# Altium project FMC_DAC_1_5GS_4CH.PrjPCB (part 3 of 4)

## Sheet DAC_FMC_connector.SchDoc: FMC DAC 1.5GS 4CH
size 420 x 297 mm; Author: G.Kasprowicz; CompanyName: WUT ISE; DrawnBy: G.Kasprowicz; Organization: WUT ISE; Address1: PW ISE; Address2: Nowowiejska 15/19 00-665 Warsaw; Address3: gkasprow@gmail.com; Revision: 1; SheetNumber: -; SheetTotal: -; ModifiedBy: -; CheckedDate: -; Title2: FMC; DivGrp: WUT ISE; Designer: G.Kasprowicz; ModifiedDate: -; ProjectName: Sensor Box
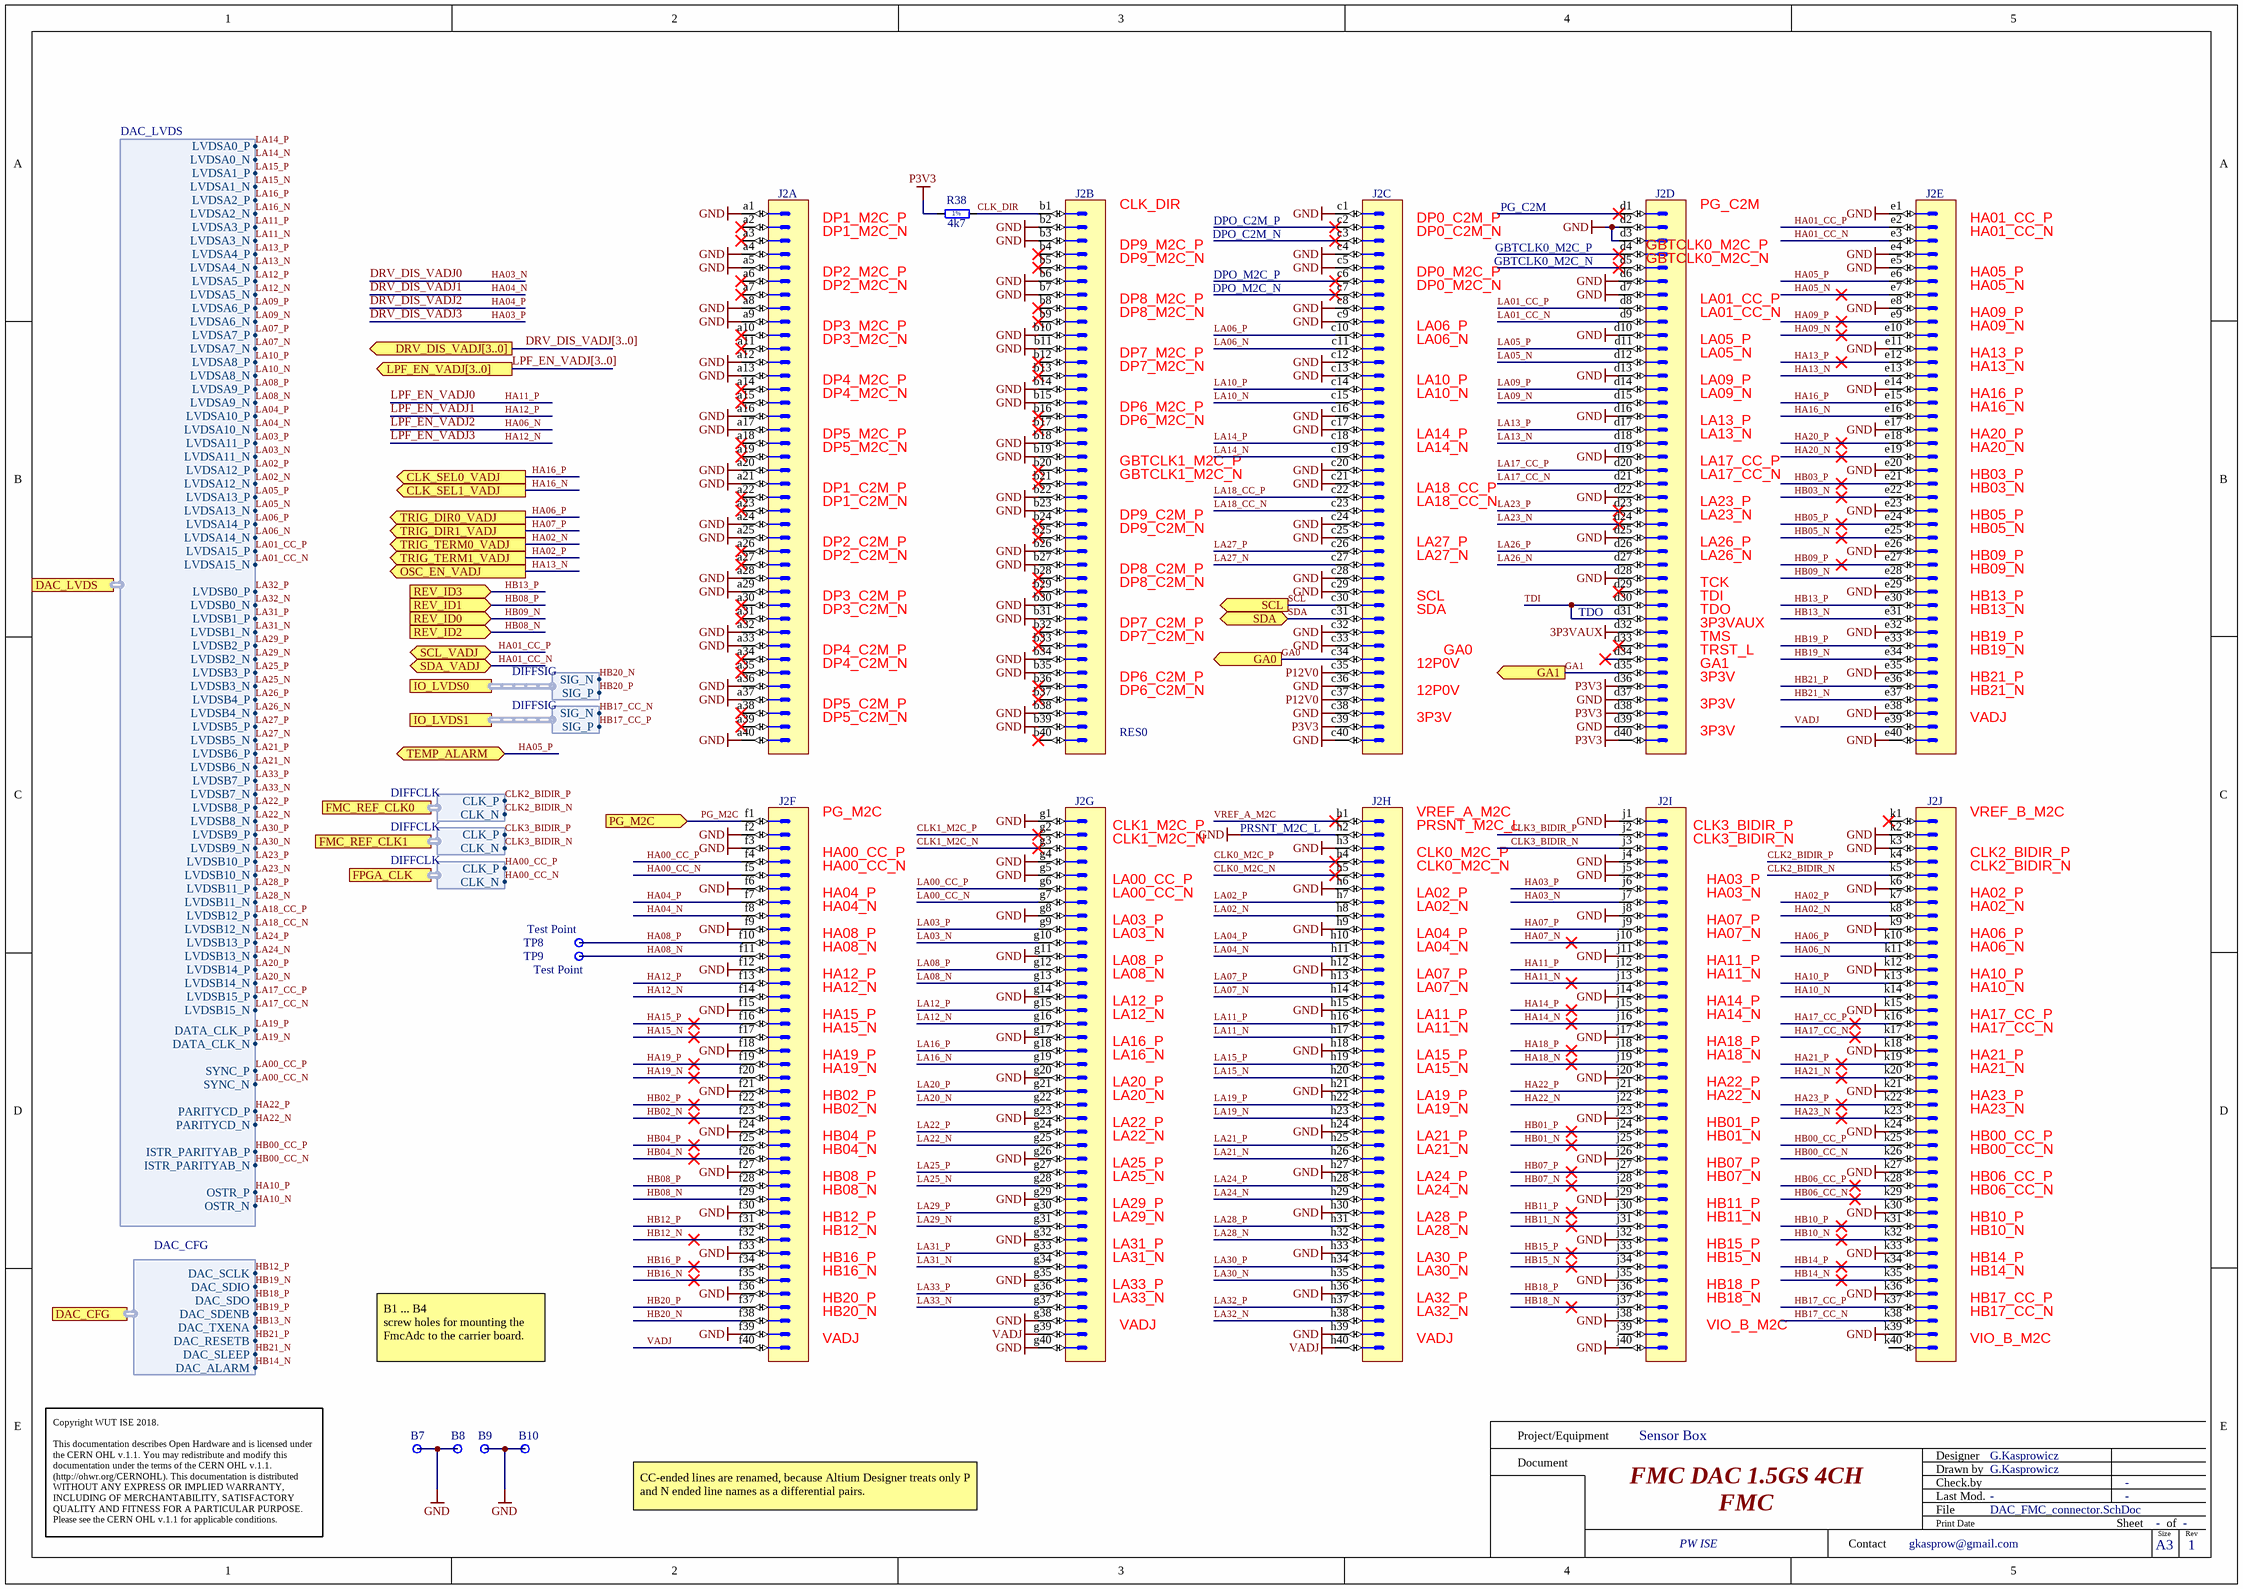
[diagram p5: DAC_FMC_connector.SchDoc]

### Parts
B7  Plated Hole  [MTG300_600]  (value not drawn)  (no BOM)
B8  Plated Hole  [MTG300_600]  (value not drawn)  (no BOM)
B9  Plated Hole  [MTG300_600]  (value not drawn)  (no BOM)
B10  Plated Hole  [MTG300_600]  (value not drawn)  (no BOM)
J2  VITA 57  [SAMTEC_ASP-134488-01]  (value not drawn)  (parts A,B,C,D,E,F,G,H,I,J of 10)
R38  4k7  [RESC1608X55N]
TP8  Test Point  [TPS127]  (no BOM)
TP9  Test Point  [TPS127]  (no BOM)

### Ports
CLK_SEL0_VADJ (out), CLK_SEL1_VADJ (out), DAC_CFG (harness DAC_CFG), DAC_LVDS (harness DAC_LVDS), DRV_DIS_VADJ[3..0] (out), FMC_REF_CLK0 (harness DIFFCLK), FMC_REF_CLK1 (harness DIFFCLK), FPGA_CLK (harness DIFFCLK), GA0 (out), GA1 (out), IO_LVDS0 (harness DIFFSIG), IO_LVDS1 (harness DIFFSIG), LPF_EN_VADJ[3..0] (out), OSC_EN_VADJ (out), PG_M2C (in), REV_ID0 (in), REV_ID1 (in), REV_ID2 (in), REV_ID3 (in), SCL (out), SCL_VADJ (bidir), SDA (bidir), SDA_VADJ (bidir), TEMP_ALARM (bidir), TRIG_DIR0_VADJ (out), TRIG_DIR1_VADJ (out), TRIG_TERM0_VADJ (out), TRIG_TERM1_VADJ (out)

### Harnesses
DAC_LVDS: LVDSA0_P, LVDSA0_N, LVDSA1_P, LVDSA1_N, LVDSA2_P, LVDSA2_N, LVDSA3_P, LVDSA3_N, LVDSA4_P, LVDSA4_N, LVDSA5_P, LVDSA5_N, LVDSA6_P, LVDSA6_N, LVDSA7_P, LVDSA7_N, LVDSA8_P, LVDSA8_N, LVDSA9_P, LVDSA9_N, LVDSA10_P, LVDSA10_N, LVDSA11_P, LVDSA11_N, LVDSA12_P, LVDSA12_N, LVDSA13_P, LVDSA13_N, LVDSA14_P, LVDSA14_N, LVDSA15_P, LVDSA15_N, LVDSB0_P, LVDSB0_N, LVDSB1_P, LVDSB1_N, LVDSB2_P, LVDSB2_N, LVDSB3_P, LVDSB3_N, LVDSB4_P, LVDSB4_N, LVDSB5_P, LVDSB5_N, LVDSB6_P, LVDSB6_N, LVDSB7_P, LVDSB7_N, LVDSB8_P, LVDSB8_N, LVDSB9_P, LVDSB9_N, LVDSB10_P, LVDSB10_N, LVDSB11_P, LVDSB11_N, LVDSB12_P, LVDSB12_N, LVDSB13_P, LVDSB13_N, LVDSB14_P, LVDSB14_N, LVDSB15_P, LVDSB15_N, DATA_CLK_P, DATA_CLK_N, SYNC_P, SYNC_N, PARITYCD_P, PARITYCD_N, ISTR_PARITYAB_P, ISTR_PARITYAB_N, OSTR_P, OSTR_N
DAC_CFG: DAC_SCLK, DAC_SDIO, DAC_SDO, DAC_SDENB, DAC_TXENA, DAC_RESETB, DAC_SLEEP, DAC_ALARM
DIFFCLK: CLK_P, CLK_N
DIFFSIG: SIG_N, SIG_P

### Nets
3P3VAUX: J2.d32
GND: B7.1 B8.1 B9.1 B10.1 J2.a1 J2.a4 J2.a5 J2.a8 J2.a9 J2.a12 J2.a13 J2.a16 J2.a17 J2.a20 J2.a21 J2.a24 J2.a25 J2.a28 J2.a29 J2.a32 J2.a33 J2.a36 J2.a37 J2.a40 J2.b2 J2.b3 J2.b6 J2.b7 J2.b10 J2.b11 J2.b14 J2.b15 J2.b18 J2.b19 J2.b22 J2.b23 J2.b26 J2.b27 J2.b30 J2.b31 J2.b34 J2.b35 J2.b38 J2.b39 J2.c1 J2.c4 J2.c5 J2.c8 J2.c9 J2.c12 J2.c13 J2.c16 J2.c17 J2.c20 J2.c21 J2.c24 J2.c25 J2.c28 J2.c29 J2.c32 J2.c33 J2.c36 J2.c38 J2.c40 J2.d2 J2.d3 J2.d6 J2.d7 J2.d10 J2.d13 J2.d16 J2.d19 J2.d22 J2.d25 J2.d28 J2.d37 J2.d39 J2.e1 J2.e4 J2.e5 J2.e8 J2.e11 J2.e14 J2.e17 J2.e20 J2.e23 J2.e26 J2.e29 J2.e32 J2.e35 J2.e38 J2.e40 J2.f2 J2.f3 J2.f6 J2.f9 J2.f12 J2.f15 J2.f18 J2.f21 J2.f24 J2.f27 J2.f30 J2.f33 J2.f36 J2.f39 J2.g1 J2.g4 J2.g5 J2.g8 J2.g11 J2.g14 J2.g17 J2.g20 J2.g23 J2.g26 J2.g29 J2.g32 J2.g35 J2.g38 J2.g40 J2.h2 J2.h3 J2.h6 J2.h9 J2.h12 J2.h15 J2.h18 J2.h21 J2.h24 J2.h27 J2.h30 J2.h33 J2.h36 J2.h39 J2.j1 J2.j4 J2.j5 J2.j8 J2.j11 J2.j14 J2.j17 J2.j20 J2.j23 J2.j26 J2.j29 J2.j32 J2.j35 J2.j38 J2.j40 J2.k2 J2.k3 J2.k6 J2.k9 J2.k12 J2.k15 J2.k18 J2.k21 J2.k24 J2.k27 J2.k30 J2.k33 J2.k36 J2.k39
P3V3: J2.c39 J2.d36 J2.d38 J2.d40 R38.1
P12V0: J2.c35 J2.c37
VADJ: J2.e39 J2.f40 J2.g39 J2.h40
CLK0_M2C_N: J2.h5
CLK0_M2C_P: J2.h4
CLK1_M2C_N: J2.g3
CLK1_M2C_P: J2.g2
CLK2_BIDIR_N: J2.k5 ; port FMC_REF_CLK0.CLK_N
CLK2_BIDIR_P: J2.k4 ; port FMC_REF_CLK0.CLK_P
CLK3_BIDIR_N: J2.j3 ; port FMC_REF_CLK1.CLK_N
CLK3_BIDIR_P: J2.j2 ; port FMC_REF_CLK1.CLK_P
CLK_DIR: J2.b1 R38.2
DRV_DIS_VADJ0: J2.j7  [also labelled HA03_N]
DRV_DIS_VADJ1: J2.f8  [also labelled HA04_N]
DRV_DIS_VADJ2: J2.f7  [also labelled HA04_P]
DRV_DIS_VADJ3: J2.j6  [also labelled HA03_P]
GA0: J2.c34 ; port GA0
GA1: J2.d35 ; port GA1
HA00_CC_N: J2.f5 ; port FPGA_CLK.CLK_N
HA00_CC_P: J2.f4 ; port FPGA_CLK.CLK_P
HA01_CC_N: J2.e3 ; port SDA_VADJ
HA01_CC_P: J2.e2 ; port SCL_VADJ
HA02_N: J2.k8 ; port TRIG_TERM0_VADJ
HA02_P: J2.k7 ; port TRIG_TERM1_VADJ
HA05_N: J2.e7
HA05_P: J2.e6 ; port TEMP_ALARM
HA06_N: J2.k11  [also labelled LPF_EN_VADJ2]
HA06_P: J2.k10 ; port TRIG_DIR0_VADJ
HA07_N: J2.j10
HA07_P: J2.j9 ; port TRIG_DIR1_VADJ
HA08_N: J2.f11 TP9.1
HA08_P: J2.f10 TP8.1
HA09_N: J2.e10
HA09_P: J2.e9
HA10_N: J2.k14 ; port DAC_LVDS.OSTR_N
HA10_P: J2.k13 ; port DAC_LVDS.OSTR_P
HA11_N: J2.j13
HA11_P: J2.j12  [also labelled LPF_EN_VADJ0]
HA12_N: J2.f14  [also labelled LPF_EN_VADJ3]
HA12_P: J2.f13  [also labelled LPF_EN_VADJ1]
HA13_N: J2.e13 ; port OSC_EN_VADJ
HA13_P: J2.e12
HA14_N: J2.j16
HA14_P: J2.j15
HA15_N: J2.f17
HA15_P: J2.f16
HA16_N: J2.e16 ; port CLK_SEL1_VADJ
HA16_P: J2.e15 ; port CLK_SEL0_VADJ
HA17_CC_N: J2.k17
HA17_CC_P: J2.k16
HA18_N: J2.j19
HA18_P: J2.j18
HA19_N: J2.f20
HA19_P: J2.f19
HA20_N: J2.e19
HA20_P: J2.e18
HA21_N: J2.k20
HA21_P: J2.k19
HA22_N: J2.j22 ; port DAC_LVDS.PARITYCD_N
HA22_P: J2.j21 ; port DAC_LVDS.PARITYCD_P
HA23_N: J2.k23
HA23_P: J2.k22
HB00_CC_N: J2.k26 ; port DAC_LVDS.ISTR_PARITYAB_N
HB00_CC_P: J2.k25 ; port DAC_LVDS.ISTR_PARITYAB_P
HB01_N: J2.j25
HB01_P: J2.j24
HB02_N: J2.f23
HB02_P: J2.f22
HB03_N: J2.e22
HB03_P: J2.e21
HB04_N: J2.f26
HB04_P: J2.f25
HB05_N: J2.e25
HB05_P: J2.e24
HB06_CC_N: J2.k29
HB06_CC_P: J2.k28
HB07_N: J2.j28
HB07_P: J2.j27
HB08_N: J2.f29 ; port REV_ID2
HB08_P: J2.f28 ; port REV_ID1
HB09_N: J2.e28 ; port REV_ID0
HB09_P: J2.e27
HB10_N: J2.k32
HB10_P: J2.k31
HB11_N: J2.j31
HB11_P: J2.j30
HB12_N: J2.f32
HB12_P: J2.f31 ; port DAC_CFG.DAC_SCLK  [project net DAC_SCLK]
HB13_N: J2.e31 ; port DAC_CFG.DAC_TXENA  [project net DAC_TXENA]
HB13_P: J2.e30 ; port REV_ID3
HB14_N: J2.k35 ; port DAC_CFG.DAC_ALARM  [project net DAC_ALARM]
HB14_P: J2.k34
HB15_N: J2.j34
HB15_P: J2.j33
HB16_N: J2.f35
HB16_P: J2.f34
HB17_CC_N: J2.k38 ; port IO_LVDS1.SIG_N
HB17_CC_P: J2.k37 ; port IO_LVDS1.SIG_P
HB18_N: J2.j37
HB18_P: J2.j36 ; port DAC_CFG.DAC_SDO  [project net DAC_SDO]
HB19_N: J2.e34 ; port DAC_CFG.DAC_SDIO  [project net DAC_SDIO]
HB19_P: J2.e33 ; port DAC_CFG.DAC_SDENB  [project net DAC_SDENB]
HB20_N: J2.f38 ; port IO_LVDS0.SIG_N
HB20_P: J2.f37 ; port IO_LVDS0.SIG_P
HB21_N: J2.e37 ; port DAC_CFG.DAC_SLEEP  [project net DAC_SLEEP]
HB21_P: J2.e36 ; port DAC_CFG.DAC_RESETB  [project net DAC_RESETB]
LA00_CC_N: J2.g7 ; port DAC_LVDS.SYNC_N
LA00_CC_P: J2.g6 ; port DAC_LVDS.SYNC_P
LA01_CC_N: J2.d9 ; port DAC_LVDS.LVDSA15_N
LA01_CC_P: J2.d8 ; port DAC_LVDS.LVDSA15_P
LA02_N: J2.h8 ; port DAC_LVDS.LVDSA12_N
LA02_P: J2.h7 ; port DAC_LVDS.LVDSA12_P
LA03_N: J2.g10 ; port DAC_LVDS.LVDSA11_N
LA03_P: J2.g9 ; port DAC_LVDS.LVDSA11_P
LA04_N: J2.h11 ; port DAC_LVDS.LVDSA10_N
LA04_P: J2.h10 ; port DAC_LVDS.LVDSA10_P
LA05_N: J2.d12 ; port DAC_LVDS.LVDSA13_N
LA05_P: J2.d11 ; port DAC_LVDS.LVDSA13_P
LA06_N: J2.c11 ; port DAC_LVDS.LVDSA14_N
LA06_P: J2.c10 ; port DAC_LVDS.LVDSA14_P
LA07_N: J2.h14 ; port DAC_LVDS.LVDSA7_N
LA07_P: J2.h13 ; port DAC_LVDS.LVDSA7_P
LA08_N: J2.g13 ; port DAC_LVDS.LVDSA9_N
LA08_P: J2.g12 ; port DAC_LVDS.LVDSA9_P
LA09_N: J2.d15 ; port DAC_LVDS.LVDSA6_N
LA09_P: J2.d14 ; port DAC_LVDS.LVDSA6_P
LA10_N: J2.c15 ; port DAC_LVDS.LVDSA8_N
LA10_P: J2.c14 ; port DAC_LVDS.LVDSA8_P
LA11_N: J2.h17 ; port DAC_LVDS.LVDSA3_N
LA11_P: J2.h16 ; port DAC_LVDS.LVDSA3_P
LA12_N: J2.g16 ; port DAC_LVDS.LVDSA5_N
LA12_P: J2.g15 ; port DAC_LVDS.LVDSA5_P
LA13_N: J2.d18 ; port DAC_LVDS.LVDSA4_N
LA13_P: J2.d17 ; port DAC_LVDS.LVDSA4_P
LA14_N: J2.c19 ; port DAC_LVDS.LVDSA0_N
LA14_P: J2.c18 ; port DAC_LVDS.LVDSA0_P
LA15_N: J2.h20 ; port DAC_LVDS.LVDSA1_N
LA15_P: J2.h19 ; port DAC_LVDS.LVDSA1_P
LA16_N: J2.g19 ; port DAC_LVDS.LVDSA2_N
LA16_P: J2.g18 ; port DAC_LVDS.LVDSA2_P
LA17_CC_N: J2.d21 ; port DAC_LVDS.LVDSB15_N
LA17_CC_P: J2.d20 ; port DAC_LVDS.LVDSB15_P
LA18_CC_N: J2.c23 ; port DAC_LVDS.LVDSB12_N
LA18_CC_P: J2.c22 ; port DAC_LVDS.LVDSB12_P
LA19_N: J2.h23 ; port DAC_LVDS.DATA_CLK_N  [project net DATA_CLK_N]
LA19_P: J2.h22 ; port DAC_LVDS.DATA_CLK_P  [project net DATA_CLK_P]
LA20_N: J2.g22 ; port DAC_LVDS.LVDSB14_N
LA20_P: J2.g21 ; port DAC_LVDS.LVDSB14_P
LA21_N: J2.h26 ; port DAC_LVDS.LVDSB6_N
LA21_P: J2.h25 ; port DAC_LVDS.LVDSB6_P
LA22_N: J2.g25 ; port DAC_LVDS.LVDSB8_N
LA22_P: J2.g24 ; port DAC_LVDS.LVDSB8_P
LA23_N: J2.d24 ; port DAC_LVDS.LVDSB10_N
LA23_P: J2.d23 ; port DAC_LVDS.LVDSB10_P
LA24_N: J2.h29 ; port DAC_LVDS.LVDSB13_N
LA24_P: J2.h28 ; port DAC_LVDS.LVDSB13_P
LA25_N: J2.g28 ; port DAC_LVDS.LVDSB3_N
LA25_P: J2.g27 ; port DAC_LVDS.LVDSB3_P
LA26_N: J2.d27 ; port DAC_LVDS.LVDSB4_N
LA26_P: J2.d26 ; port DAC_LVDS.LVDSB4_P
LA27_N: J2.c27 ; port DAC_LVDS.LVDSB5_N
LA27_P: J2.c26 ; port DAC_LVDS.LVDSB5_P
LA28_N: J2.h32 ; port DAC_LVDS.LVDSB11_N
LA28_P: J2.h31 ; port DAC_LVDS.LVDSB11_P
LA29_N: J2.g31 ; port DAC_LVDS.LVDSB2_N
LA29_P: J2.g30 ; port DAC_LVDS.LVDSB2_P
LA30_N: J2.h35 ; port DAC_LVDS.LVDSB9_N
LA30_P: J2.h34 ; port DAC_LVDS.LVDSB9_P
LA31_N: J2.g34 ; port DAC_LVDS.LVDSB1_N
LA31_P: J2.g33 ; port DAC_LVDS.LVDSB1_P
LA32_N: J2.h38 ; port DAC_LVDS.LVDSB0_N
LA32_P: J2.h37 ; port DAC_LVDS.LVDSB0_P
LA33_N: J2.g37 ; port DAC_LVDS.LVDSB7_N
LA33_P: J2.g36 ; port DAC_LVDS.LVDSB7_P
PG_M2C: J2.f1 ; port PG_M2C
SCL: J2.c30 ; port SCL
SDA: J2.c31 ; port SDA
TDI: J2.d30 J2.d31
VREF_A_M2C: J2.h1

Not connected (* = marked no-connect by the designer): J2 a2* a3* a6* a7* a10* a11* a14* a15* a18* a19* a22* a23* a26* a27* a30* a31* a34* a35* a38* a39* b4* b5* b8* b9* b12* b13* b16* b17* b20* b21* b24* b25* b28* b29* b32* b33* b36* b37* b40* c2* c3* c6* c7* d1* d4* d5* d29* d33* d34* j39 k1* k40

### Buses and harness runs
bus DRV_DIS_VADJ[3..0] = port DRV_DIS_VADJ[3..0]
bus LPF_EN_VADJ[3..0] = port LPF_EN_VADJ[3..0]

### Notes on the sheet
- DP1_M2C_P
- DP1_M2C_N
- CLK_DIR
- DP9_M2C_P
- DP9_M2C_N
- DPO_C2M_P
- DPO_C2M_N
- DP0_C2M_P
- DP0_C2M_N
- PG_C2M
- GBTCLK0_M2C_P
- GBTCLK0_M2C_N
- (near J2) GBTCLK0_M2C_P
- (near J2) GBTCLK0_M2C_N
- HA01_CC_P
- HA01_CC_N
- DP2_M2C_P
- DP2_M2C_N
- DP8_M2C_P
- DP8_M2C_N
- DPO_M2C_P
- DPO_M2C_N
- DP0_M2C_P
- DP0_M2C_N
- LA01_CC_P
- LA01_CC_N
- HA05_P
- HA05_N
- HA09_P
- DP3_M2C_P
- DP3_M2C_N
- DP4_M2C_P
- DP4_M2C_N
- DP7_M2C_P
- DP7_M2C_N
- LA06_P
- LA06_N
- LA10_P
- LA10_N
- LA05_P
- LA05_N
- LA09_P
- LA09_N
- HA09_N
- HA13_P
- HA13_N
- HA16_P
- DP5_M2C_P
- DP5_M2C_N
- DP6_M2C_P
- DP6_M2C_N
- LA14_P
- LA14_N
- LA13_P
- LA13_N
- HA16_N
- HA20_P
- HA20_N
- DP1_C2M_P
- DP1_C2M_N
- GBTCLK1_M2C_P
- GBTCLK1_M2C_N
- DP9_C2M_P
- DP9_C2M_N
- LA18_CC_P
- LA18_CC_N
- LA17_CC_P
- LA17_CC_N
- LA23_P
- LA23_N
- HB03_P
- HB03_N
- HB05_P
- HB05_N
- DP2_C2M_P
- DP2_C2M_N
- DP8_C2M_P
- DP8_C2M_N
- LA27_P
- LA27_N
- LA26_P
- LA26_N
- TCK
- HB09_P
- HB09_N
- DP3_C2M_P
- DP3_C2M_N
- DP4_C2M_P
- DP4_C2M_N
- DP7_C2M_P
- DP7_C2M_N
- SCL
- SDA
- 12P0V
- GA0
- (near J2) TDO
- TDI
- TDO
- 3P3VAUX
- TMS
- TRST_L
- GA1
- HB13_P
- HB13_N
- HB19_P
- HB19_N
- DP5_C2M_P
- DP5_C2M_N
- DP6_C2M_P
- DP6_C2M_N
- 3P3V
- HB21_P
- HB21_N
- VADJ
- RES0
- PG_M2C
- HA00_CC_P
- (near J2) CLK1_M2C_P
- (near J2) CLK1_M2C_N
- (near J2) PRSNT_M2C_L
- VREF_A_M2C
- PRSNT_M2C_L
- CLK0_M2C_P
- (near J2) CLK3_BIDIR_P
- (near J2) CLK3_BIDIR_N
- VREF_B_M2C
- CLK2_BIDIR_P
- HA00_CC_N
- HA04_P
- HA04_N
- HA08_P
- (near J2) LA00_CC_P
- (near J2) LA00_CC_N
- (near J2) LA03_P
- (near J2) LA03_N
- CLK0_M2C_N
- LA02_P
- LA02_N
- LA04_P
- HA03_P
- HA03_N
- HA07_P
- HA07_N
- CLK2_BIDIR_N
- HA02_P
- HA02_N
- HA06_P
- HA08_N
- HA12_P
- HA12_N
- (near J2) LA08_P
- (near J2) LA08_N
- LA04_N
- LA07_P
- LA07_N
- HA11_P
- HA11_N
- HA06_N
- HA10_P
- HA10_N
- HA15_P
- HA15_N
- HA19_P
- HA19_N
- (near J2) LA12_P
- (near J2) LA12_N
- (near J2) LA16_P
- (near J2) LA16_N
- LA11_P
- LA11_N
- LA15_P
- LA15_N
- HA14_P
- HA14_N
- HA18_P
- HA18_N
- HA17_CC_P
- HA17_CC_N
- HA21_P
- HA21_N
- HB02_P
- HB02_N
- (near J2) LA20_P
- (near J2) LA20_N
- (near J2) LA22_P
- LA19_P
- LA19_N
- HA22_P
- HA22_N
- HB01_P
- HA23_P
- HA23_N
- HB04_P
- HB04_N
- HB08_P
- HB08_N
- (near J2) LA22_N
- (near J2) LA25_P
- (near J2) LA25_N
- (near J2) LA29_P
- LA21_P
- LA21_N
- LA24_P
- LA24_N
- HB01_N
- HB07_P
- HB07_N
- HB11_P
- HB00_CC_P
- HB00_CC_N
- HB06_CC_P
- HB06_CC_N
- HB12_P
- HB12_N
- HB16_P
- (near J2) LA29_N
- (near J2) LA31_P
- (near J2) LA31_N
- LA28_P
- LA28_N
- LA30_P
- HB11_N
- HB15_P
- HB15_N
- HB10_P
- HB10_N
- HB14_P
- HB16_N
- HB20_P
- HB20_N
- (near J2) LA33_P
- (near J2) LA33_N
- LA30_N
- LA32_P
- LA32_N
- HB18_P
- HB18_N
- VIO_B_M2C
- HB14_N
- HB17_CC_P
- HB17_CC_N
- B1 ... B4
  screw holes for mounting the FmcAdc to the carrier board.
- CC-ended lines are renamed, because Altium Designer treats only P and N ended line names as a differential pairs.
- Project/Equipment
- Document
- Designer
- Drawn by
- Check.by
- Copyright WUT ISE 2018.
  This documentation describes Open Hardware and is licensed under the CERN OHL v.1.1. You may redistribute and modify this documentation under the terms of the CERN OHL v.1.1. (http://ohwr.org/CERNOHL). This documentation is distributed WITHOUT ANY EXPRESS OR IMPLIED WARRANTY, INCLUDING OF MERCHANTABILITY, SATISFACTORY QUALITY AND FITNESS FOR A PARTICULAR PURPOSE. Please see the CERN OHL v.1.1 for applicable conditions.
- Contact
- File
- Last Mod.
- Print Date
- Sheet
- Size
- A3
- of
- Rev
- (in symbol R0603_4K7_1%_0.1W_100PPM) 1%

### Library data of the parts
B7-B10 = PLATED_HOLE3.0_PAD6.0: Single Terminal Socket; Part Description: Plated Through Hole: Hole Dia.=3.0mm Pad Dia.=6.0mm; Mounted: No; Table: Pads; Part Number: PLATED_HOLE3.0_PAD6.0; Component Type: Standard (No BOM); Designator: Single Terminal Socket; Library Reference: Single Terminal Socket; Pin Count: 1; Family: Plated Hole; Socket: No; SMD: No; Status: None; ComponentHeight: 0mm; Author: CERN DEM JLC; CreateDate: 26.05.2008; LatestRevisionDate: 26.05.2008; PackageDescription: Plated Through Hole: Hole Dia.=3.0mm Pad Dia.=6.0mm
J2 = SAMTEC_ASP-134488-01: Connector VITA 57, 400 Male contacts in 10 row abcdefghj; Part Description: 400 contacts (10 rows abcdefghj) Surface Mount Male Connector, VITA 57 (MC-HPC-10); Manufacturer: SAMTEC; Part Number: SAMTEC_ASP-134488-01; Component Kind: Standard; Component Type: Standard; Pin Count: 400; Family: VITA 57; Mounted: Yes; Socket: No; SMD: Yes; Status: None; Manufacturer Part Number: ASP-134488-01; ComponentHeight: 6.1mm; HelpURL: \\cern.ch\dfs\Applications\Altium\Datasheets\SAMTEC_ASP-134488-01.pdf; Author: CERN DEM JLC; CreateDate: 30/04/2009; LatestRevisionDate: 17/08/2009; Table: SAMTEC
R38 = R0603_4K7_1%_0.1W_100PPM: Resistor - 1%; Part Description: General Purpose Thick Film Chip Resistor; Manufacturer: GENERIC; Manufacturer1 Part Number: NRC06F4701TRF; Power: 0.1W; TC: ±100ppm/°C; Table: Resistors SMD; Part Number: R0603_4K7_1%_0.1W_100PPM; Component Kind: Standard; Component Type: Standard; Pin Count: 2; Value: 4k7; Status: Preferred; Tolerance: ±1%; Manufacturer Part Number: R0603_4K7_1%_0.1W_100PPM; Case: 0603; Mounted: Yes; Socket: No; SMD: Yes; Manufacturer1 Example: NIC COMPONENT; Manufacturer1 ComponentHeight: 0.55mm; HelpURL: \\cern.ch\dfs\Applications\Altium\Datasheets\R0603_NIC_NRC.pdf; Author: CERN DEM JLC; CreateDate: 03/12/2007; LatestRevisionDate: 13/03/2008
TP8 TP9 = SMD_PAD_1.27X1.27MM: Part Description: 1.27mm x 1.27mm PCB Copper Area (SMD Test Point); Mounted: No; Part Number: SMD_PAD_1.27X1.27MM; Component Type: Standard (No BOM); Pin Count: 1; Family: Test Point; Socket: No; SMD: Yes; Sense: No; Status: None; ComponentHeight: 0mm; HelpURL: Undefined; Author: CERN DEM JLC; CreateDate: 12.01.2008; LatestRevisionDate: 12.01.2008; PackageDescription: 1.27mm x 1.27mm PCB Copper Area (SMD Test Point)

## Sheet Driver_Filter.schdoc: FMC DAC 1.5GS 4CH
size 420 x 297 mm; EDA_Number: ARTIQ; Projet: ARTIQ/SINARA; Author: G.Kasprowicz; CompanyName: WUT ISE; DrawnBy: G.Kasprowicz; Organization: WUT ISE; Address1: PW ISE; Address2: Nowowiejska 15/19 00-665 Warsaw; Address3: gkasprow@gmail.com; DocumentNumber: 1; Revision: 1; SheetNumber: 1; SheetTotal: 18; ModifiedBy: -; CheckedDate: -; Title2: Top; DivGrp: WUT ISE; Designer: G.Kasprowicz; ModifiedDate: -; ProjectName: Sensor Box
Used 4 times, as channels U_Driver_Filter0, U_Driver_Filter1, U_Driver_Filter2, U_Driver_Filter3. Parts and nets are listed once, with the designators drawn on the sheet.
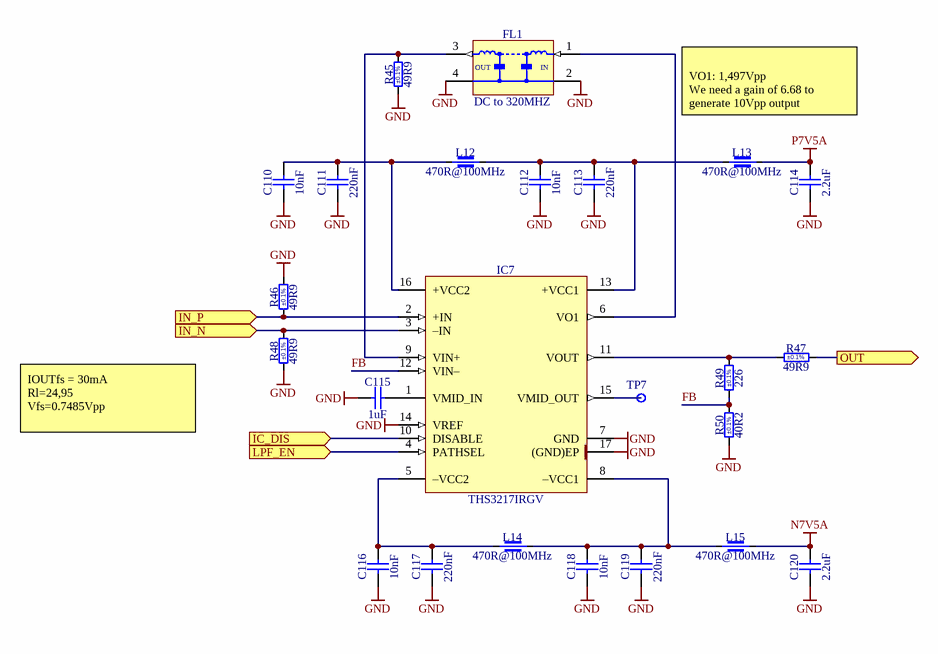
[diagram p6: Driver_Filter.schdoc]

### Parts
C110  10nF  [CAPC1005X55N]
C111  220nF  [CAPC1005X55N]
C112  10nF  [CAPC1005X55N]
C113  220nF  [CAPC1005X55N]
C114  2.2uF  [CAPC1005X55N]
C115  1uF  [CAPC1005X55N]
C116  10nF  [CAPC1005X55N]
C117  220nF  [CAPC1005X55N]
C118  10nF  [CAPC1005X55N]
C119  220nF  [CAPC1005X55N]
C120  2.2uF  [CAPC1005X55N]
FL1  DC to 320MHZ  [FIL_MINI-CIRCUITS_FV1206]
IC7  THS3217IRGV  [QFN65P400X400X100-17N-S225]
L12  470R@100MHz  [INDC1608X95N]
L13  470R@100MHz  [INDC1608X95N]
L14  470R@100MHz  [INDC1608X95N]
L15  470R@100MHz  [INDC1608X95N]
R45  49R9  Tolerance: ±0.1%  [RESC1608X55N]
R46  49R9  Tolerance: ±0.1%  [RESC1608X55N]
R47  49R9  Tolerance: ±0.1%  [RESC1608X55N]
R48  49R9  Tolerance: ±0.1%  [RESC1608X55N]
R49  226  Tolerance: ±0.1%  [RESC1608X55N]
R50  40R2  Tolerance: ±0.1%  [RESC1608X55N]
TP7  Test Point  [TPS127]  (value not drawn)  (no BOM)

### Ports
IC_DIS (in), IN_N (in), IN_P (in), LPF_EN (in), OUT (out)

### Nets
GND: C110.1 C111.1 C112.1 C113.1 C114.1 C115.1 C116.1 C117.1 C118.1 C119.1 C120.1 FL1.2(GND) FL1.4(GND) IC7.7(GND) IC7.14(VREF) IC7.17((GND)EP) R45.1 R46.2 R48.1 R50.1
N7V5A: C120.2 L15.2
P7V5A: C114.2 L13.2
FB: IC7.12(VIN–) R49.1 R50.2
IC_DIS: IC7.10(DISABLE) ; port IC_DIS
IN_N: IC7.3(–IN) R48.2 ; port IN_N
IN_P: IC7.2(+IN) R46.1 ; port IN_P
LPF_EN: IC7.4(PATHSEL) ; port LPF_EN
OUT: R47.2 ; port OUT
NetC110_2: C110.2 C111.2 IC7.16(+VCC2) L12.1
NetC112_2: C112.2 C113.2 IC7.13(+VCC1) L12.2 L13.1
NetC115_2: C115.2 IC7.1(VMID_IN)
NetC116_2: C116.2 C117.2 IC7.5(–VCC2) L14.1
NetC118_2: C118.2 C119.2 IC7.8(–VCC1) L14.2 L15.1
NetFL1_1: FL1.1(RFIN) IC7.6(VO1)
NetFL1_3: FL1.3(RFOUT) IC7.9(VIN+) R45.2
NetIC7_11: IC7.11(VOUT) R47.1 R49.2
NetIC7_15: IC7.15(VMID_OUT) TP7.1

### Channels
U_Driver_Filter0: designators end in A; ports IC_DIS=DRV_DIS0 IN_N=IOUTA_N IN_P=IOUTA_P LPF_EN=LPF_EN0 OUT=NetJ3_1
U_Driver_Filter1: designators end in B; ports IC_DIS=DRV_DIS1 IN_N=IOUTB_N IN_P=IOUTB_P LPF_EN=LPF_EN1 OUT=NetJ4_1
U_Driver_Filter2: designators end in C; ports IC_DIS=DRV_DIS2 IN_N=IOUTC_N IN_P=IOUTC_P LPF_EN=LPF_EN2 OUT=NetJ6_1
U_Driver_Filter3: designators end in D; ports IC_DIS=DRV_DIS3 IN_N=IOUTD_N IN_P=IOUTD_P LPF_EN=LPF_EN3 OUT=NetJ7_1

### Notes on the sheet
- VO1: 1,497Vpp
  We need a gain of 6.68 to generate 10Vpp output
- IOUTfs = 30mA
  Rl=24,95
  Vfs=0.7485Vpp
- Project/Equipment
- Document
- Designer
- Drawn by
- Check.by
- Copyright WUT ISE 2018.
  This documentation describes Open Hardware and is licensed under the CERN OHL v.1.1. You may redistribute and modify this documentation under the terms of the CERN OHL v.1.1. (http://ohwr.org/CERNOHL). This documentation is distributed WITHOUT ANY EXPRESS OR IMPLIED WARRANTY, INCLUDING OF MERCHANTABILITY, SATISFACTORY QUALITY AND FITNESS FOR A PARTICULAR PURPOSE. Please see the CERN OHL v.1.1 for applicable conditions.
- Contact
- File
- Last Mod.
- Print Date
- Sheet
- Size
- A3
- of
- Rev
- (in symbol FIL_MINI-CIRCUITS_LFCN-320+) OUT; IN

### Library data of the parts
C110 C112 C116 C118 = CC0402_10NF_16V_10%_X7R: Non-polarised capacitor; Part Description: SMD Multilayer Chip Ceramic Capacitor; Manufacturer: GENERIC; Manufacturer1 Part Number: 223878715636; Voltage: 16V; TC: X7R; Tolerance: ±10%; Part Number: CC0402_10NF_16V_10%_X7R; Component Kind: Standard; Component Type: Standard; Pin Count: 2; Value: 10nF; Status: Not Recommended; Manufacturer Part Number: CC0402_10NF_16V_10%_X7R; Case: 0402; Mounted: Yes; Socket: No; SMD: Yes; Sense: No; Manufacturer1 Example: PHYCOMP; Manufacturer1 ComponentHeight: 0.55mm; HelpURL: \\cern.ch\dfs\Applications\Altium\Datasheets\CC0402_X7R_PHYCOMP.pdf; Author: CERN DEM JLC; CreateDate: 03.12.2007; LatestRevisionDate: 03.12.2007
C111 C113 C117 C119 = CC0402_220NF_16V_10%_X7R: Non-polarised capacitor; Part Description: SMD Multilayer Chip Ceramic Capacitor; Manufacturer: GENERIC; Manufacturer1 Part Number: C1005X7R1C224K050; Voltage: 16V; TC: X7R; Tolerance: ±10%; Part Number: CC0402_220NF_16V_10%_X7R; Component Kind: Standard; Component Type: Standard; Pin Count: 2; Value: 220nF; Status: Preferred; Manufacturer Part Number: CC0402_220NF_16V_10%_X7R; Case: 0402; Mounted: Yes; Socket: No; SMD: Yes; Sense: No; Manufacturer1 Example: TDK; Manufacturer1 ComponentHeight: 0.55mm; HelpURL: \\cern.ch\dfs\Applications\Altium\Datasheets\CC0402_X7R_TDK_C.pdf; Author: CERN DEM JLC; CreateDate: 25.10.2012; LatestRevisionDate: 25.10.2012
C114 C120 = CC0402_2.2UF_16V_10%_X5R: Non-polarised capacitor; Part Description: SMD Multilayer Chip Ceramic Capacitor; Manufacturer: GENERIC; Manufacturer1 Part Number: C1005X5R1C225K050BC; Voltage: 16V; TC: X5R; Tolerance: ±10%; Part Number: CC0402_2.2UF_16V_10%_X5R; Component Kind: Standard; Component Type: Standard; Pin Count: 2; Value: 2.2uF; Status: Preferred; Manufacturer Part Number: CC0402_2.2UF_16V_10%_X5R; Case: 0402; Mounted: Yes; Socket: No; SMD: Yes; Sense: No; Manufacturer1 Example: TDK; Manufacturer1 ComponentHeight: 0.55mm; HelpURL: \\cern.ch\dfs\Applications\Altium\Datasheets\CC0402_X5R_TDK_C.pdf; Author: CERN DEM BC; CreateDate: 08.02.2021; LatestRevisionDate: 08.02.2021
C115 = CC0402_1UF_16V_10%_X5R: Non-polarised capacitor; Part Description: SMD Multilayer Chip Ceramic Capacitor; Manufacturer: GENERIC; Manufacturer1 Part Number: C1005X5R1C105KT; Voltage: 16V; TC: X5R; Tolerance: ±10%; Part Number: CC0402_1UF_16V_10%_X5R; Component Kind: Standard; Component Type: Standard; Pin Count: 2; Value: 1uF; Status: Preferred; Manufacturer Part Number: CC0402_1UF_16V_10%_X5R; Case: 0402; Mounted: Yes; Socket: No; SMD: Yes; Sense: No; Manufacturer1 Example: TDK; Manufacturer1 ComponentHeight: 0.55mm; HelpURL: \\cern.ch\dfs\Applications\Altium\Datasheets\CC0402_X5R_TDK_C.pdf; Author: CERN DEM JLC; CreateDate: 25.10.2012; LatestRevisionDate: 25.10.2012
FL1 = FIL_MINI-CIRCUITS_LFCN-320+: 50 Ohm Low Pass Filter; Part Number: FIL_MINI-CIRCUITS_LFCN-320+; Component Kind: Standard; Component Type: Standard; Pin Count: 4; Value: DC to 320MHZ; Part Description: 50 Ohm Low Pass Filter; Manufacturer: MINI-CIRCUITS; Manufacturer Part Number: LFCN-320+; Mounted: Yes; Socket: No; SMD: Yes; Sense: No; ComponentHeight: 0.94mm; HelpURL: \\cern.ch\dfs\Applications\Altium\Datasheets\FIL_MINI-CIRCUITS_LFCN-320+.pdf; Author: CERN DEM MR; CreateDate: 29.09.2017; LatestRevisionDate: 29.09.2017
IC7 = THS3217IRGV: DC to 800-MHz, Differential-to-Single-Ended, DAC Output Amplifier; Manufacturer: TEXAS INSTRUMENTS; PressFit: No; Bonding: No; Part Number: THS3217IRGV; Component Kind: Standard; Component Type: Standard; Device: THS3217IRGV; PackageDescription: QFN, 0.65mm Pitch; Square; 16 Pin, 4.00mm L X 4.00mm W X 1.00mm H body (w/Thermal Tab 2.25 X 2.25mm), IPC Medium Density; Part Description: DC to 800-MHz, Differential-to-Single-Ended, DAC Output Amplifier; Manufacturer Part Number: THS3217IRGV; Pin Count: 17; Case: QFN16; Mounted: Yes; Socket: No; SMD: Yes; Sense: No; ComponentHeight: 1mm; Author: CERN DEM HF; HelpURL: \\cern.ch\dfs\Applications\Altium\Datasheets\THS3217.pdf; CreateDate: 22.10.2021; LatestRevisionDate: 22.10.2021
L12-L15 = IND0603_MURATA_BLM18PG471SN1D: Part Description: SMD EMIFIL Chip Ferrite Bead; Manufacturer: MURATA; Power: 1A; Resistance: 0.2R; Tolerance: ±25%; Part Number: IND0603_MURATA_BLM18PG471SN1D; Component Kind: Standard; Component Type: Standard; Pin Count: 2; Value: 470R@100MHz; Manufacturer Part Number: BLM18PG471SN1D; Case: 0603; Mounted: Yes; Socket: No; SMD: Yes; Sense: No; ComponentHeight: 0.95mm; HelpURL: \\cern.ch\dfs\Applications\Altium\Datasheets\IND0603_MURATA_BLM18P.pdf; Author: CERN DEM BC; CreateDate: 17.02.2021; LatestRevisionDate: 17.02.2021
R45-R48 = R0603_49R9_0.1%_0.063W_10PPM: Resistor - 0.1%; Part Description: Thin Film Chip Resistor; Manufacturer: GENERIC; Manufacturer1 Part Number: RN73C1J49R9BTDF; Power: 0.063W; TC: ±10ppm; PressFit: No; Part Number: R0603_49R9_0.1%_0.063W_10PPM; Component Kind: Standard; Component Type: Standard; Pin Count: 2; Value: 49R9; Status: Not Recommended; Manufacturer Part Number: R0603_49R9_0.1%_0.063W_10PPM; Case: 0603; Mounted: Yes; Sense: No; Socket: No; SMD: Yes; Manufacturer1 Example: TYCO HOLSWORTHY; Manufacturer1 ComponentHeight: 0.5mm; HelpURL: \\cern.ch\dfs\Applications\Altium\Datasheets\R0603_Tyco_RN73.pdf; Author: CERN DEM JLC; CreateDate: 03.12.2007; LatestRevisionDate: 13.03.2008
R49 = R0603_226R_0.1%_0.063W_10PPM: Resistor - 0.1%; Part Description: Thin Film Chip Resistor; Manufacturer: GENERIC; Manufacturer1 Part Number: RN73C1J226RBTDF; Power: 0.063W; TC: ±10ppm; PressFit: No; Part Number: R0603_226R_0.1%_0.063W_10PPM; Component Kind: Standard; Component Type: Standard; Pin Count: 2; Value: 226; Status: Not Recommended; Manufacturer Part Number: R0603_226R_0.1%_0.063W_10PPM; Case: 0603; Mounted: Yes; Sense: No; Socket: No; SMD: Yes; Manufacturer1 Example: TYCO HOLSWORTHY; Manufacturer1 ComponentHeight: 0.5mm; HelpURL: \\cern.ch\dfs\Applications\Altium\Datasheets\R0603_Tyco_RN73.pdf; Author: CERN DEM JLC; CreateDate: 03.12.2007; LatestRevisionDate: 13.03.2008
R50 = R0603_40R2_0.1%_0.063W_10PPM: Resistor - 0.1%; Part Description: Thin Film Chip Resistor; Manufacturer: GENERIC; Manufacturer1 Part Number: RN73C1J40R2BTDF; Power: 0.063W; TC: ±10ppm; PressFit: No; Part Number: R0603_40R2_0.1%_0.063W_10PPM; Component Kind: Standard; Component Type: Standard; Pin Count: 2; Value: 40R2; Status: Not Recommended; Manufacturer Part Number: R0603_40R2_0.1%_0.063W_10PPM; Case: 0603; Mounted: Yes; Sense: No; Socket: No; SMD: Yes; Manufacturer1 Example: TYCO HOLSWORTHY; Manufacturer1 ComponentHeight: 0.5mm; HelpURL: \\cern.ch\dfs\Applications\Altium\Datasheets\R0603_Tyco_RN73.pdf; Author: CERN DEM JLC; CreateDate: 03.12.2007; LatestRevisionDate: 13.03.2008
TP7 = SMD_PAD_1.27X1.27MM: as TP8 on sheet DAC_FMC_connector; Part Number: SMD_PAD_1.27X1.27MM; Component Type: Standard (No BOM); Pin Count: 1; Family: Test Point; Socket: No; SMD: No; Sense: No; Status: None; ComponentHeight: 0mm; HelpURL: Undefined; Author: CERN DEM JLC; CreateDate: 12.01.2008; LatestRevisionDate: 12.01.2008; PackageDescription: 1.27mm x 1.27mm PCB Copper Area (SMD Test Point)

## Sheet EEPROM_Temp.SchDoc: FMC DAC 1.5GS 4CH
size 420 x 297 mm; Author: G.Kasprowicz; CompanyName: WUT ISE; DrawnBy: G.Kasprowicz; Organization: WUT ISE; Address1: PW ISE; Address2: Nowowiejska 15/19 00-665 Warsaw; Address3: gkasprow@gmail.com; DocumentNumber: 8; Revision: 1; SheetNumber: 8; SheetTotal: 10; ModifiedBy: -; CheckedDate: -; Title2: EEPROM, temperature sensor; DivGrp: WUT ISE; Designer: G.Kasprowicz; ModifiedDate: -; ProjectName: Sensor Box
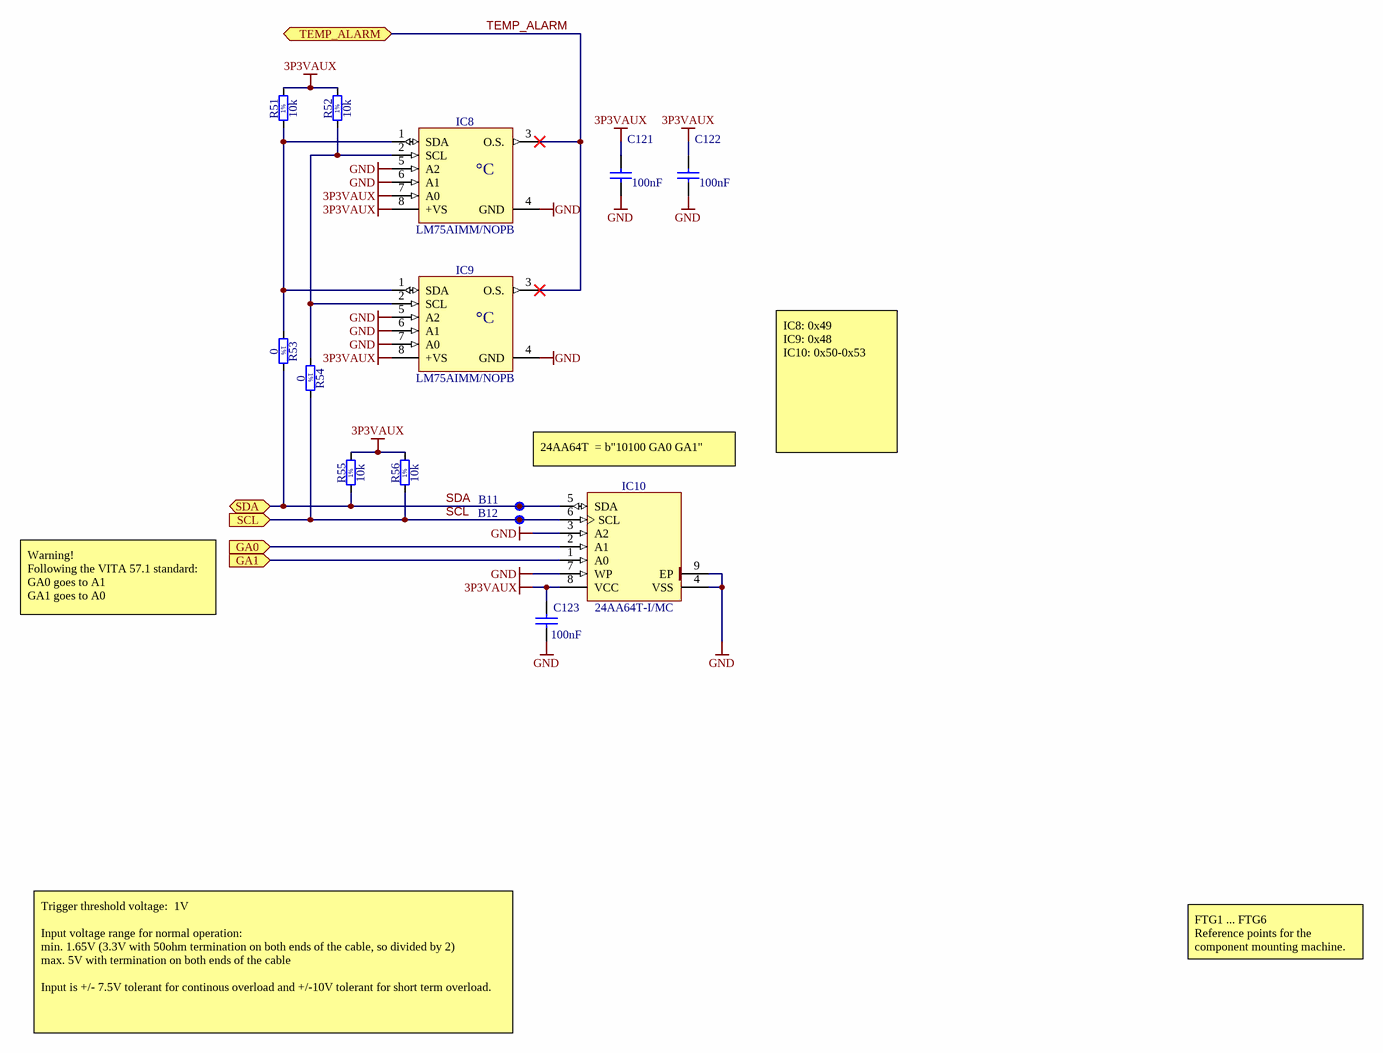
[diagram p7: EEPROM_Temp.SchDoc]

### Parts
B11  SMD Pad  [C100]  (value not drawn)  (no BOM)
B12  SMD Pad  [C100]  (value not drawn)  (no BOM)
C121  100nF  [CAPC1005X55N]
C122  100nF  [CAPC1005X55N]
C123  100nF  [CAPC1005X55N]
IC8  LM75AIMM/NOPB  [SOP65P490X109-8N]
IC9  LM75AIMM/NOPB  [SOP65P490X109-8N]
IC10  24AA64T-I/MC  [SON50P300X200X100-9N-R175X155]
R51  10k  [RESC1005X40N]
R52  10k  [RESC1005X40N]
R53  0  [RESC1005X40N]
R54  0  [RESC1005X40N]
R55  10k  [RESC1005X40N]
R56  10k  [RESC1005X40N]

### Ports
GA0 (in), GA1 (in), SCL (in), SDA (bidir), TEMP_ALARM (bidir)

### Nets
3P3VAUX: C121.1 C122.1 C123.1 IC8.7(A0) IC8.8(+VS) IC9.8(+VS) IC10.8(VCC) R51.2 R52.2 R55.2 R56.2
GND: C121.2 C122.2 C123.2 IC8.4(GND) IC8.5(A2) IC8.6(A1) IC9.4(GND) IC9.5(A2) IC9.6(A1) IC9.7(A0) IC10.3(A2) IC10.4(VSS) IC10.7(WP) IC10.9(EP)
GA0: IC10.2(A1) ; port GA0
GA1: IC10.1(A0) ; port GA1
SCL: B12.1 IC10.6(SCL) R54.2 R56.1 ; port SCL
SDA: B11.1 IC10.5(SDA) R53.2 R55.1 ; port SDA
TEMP_ALARM: IC8.3(O.S.) IC9.3(O.S.) ; port TEMP_ALARM  [project net HA05_P]
NetIC8_1: IC8.1(SDA) IC9.1(SDA) R51.1 R53.1
NetIC8_2: IC8.2(SCL) IC9.2(SCL) R52.1 R54.1

### Notes on the sheet
- 24AA64T  = b"10100 GA0 GA1"
- IC8: 0x49
  IC9: 0x48
  IC10: 0x50-0x53
- Warning!
  Following the VITA 57.1 standard:
  GA0 goes to A1
  GA1 goes to A0
- FTG1 ... FTG6
  Reference points for the component mounting machine.
- Trigger threshold voltage:  1V
  Input voltage range for normal operation:
  min. 1.65V (3.3V with 50ohm termination on both ends of the cable, so divided by 2)
  max. 5V with termination on both ends of the cable
  Input is +/- 7.5V tolerant for continous overload and +/-10V tolerant for short term overload.
- Project/Equipment
- Document
- Designer
- Drawn by
- Check.by
- Copyright WUT ISE 2018.
  This documentation describes Open Hardware and is licensed under the CERN OHL v.1.1. You may redistribute and modify this documentation under the terms of the CERN OHL v.1.1. (http://ohwr.org/CERNOHL). This documentation is distributed WITHOUT ANY EXPRESS OR IMPLIED WARRANTY, INCLUDING OF MERCHANTABILITY, SATISFACTORY QUALITY AND FITNESS FOR A PARTICULAR PURPOSE. Please see the CERN OHL v.1.1 for applicable conditions.
- Contact
- File
- Last Mod.
- Print Date
- Sheet
- Size
- A3
- of
- Rev
- (in symbol LM75AIMM/NOPB) °C
- (in symbol R0402_0R_JUMPER) 1%
- (in symbol R0402_10K_1%_0.0625W_100PPM) 1%

### Library data of the parts
B11 B12 = SMD_PAD_D1MM: Through Hole Pad; Part Description: 1mm Diameter SMD Pad; Mounted: No; Part Number: SMD_PAD_D1MM; Component Type: Standard (No BOM); Pin Count: 1; Family: SMD Pad; Socket: No; SMD: No; Sense: No; Status: None; ComponentHeight: 0mm; HelpURL: Undefined; Author: CERN DEM JLC; CreateDate: 10.10.2017; LatestRevisionDate: 10.10.2017; PackageDescription: 1mm Diameter SMD Pad
C121-C123 = CC0402_100NF_16V_10%_X5R: Non-polarised capacitor; Part Description: SMD Multilayer Chip Ceramic Capacitor; Manufacturer: GENERIC; Manufacturer1 Part Number: GRM155R61C104KA88D; Voltage: 16V; TC: X5R; Tolerance: ±10%; Part Number: CC0402_100NF_16V_10%_X5R; Component Kind: Standard; Component Type: Standard; Pin Count: 2; Value: 100nF; Status: None; Manufacturer Part Number: CC0402_100NF_16V_10%_X5R; Case: 0402; Mounted: Yes; Socket: No; SMD: Yes; Manufacturer1 Example: MURATA; Manufacturer1 ComponentHeight: 0.55mm; HelpURL: \\cern.ch\dfs\Applications\Altium\Datasheets\CC0402_X5R_MURATA_GRM.pdf; Author: CERN DEM JLC; CreateDate: 10.12.2013; LatestRevisionDate: 10.12.2013; Sense: No
IC8 IC9 = LM75AIMM/NOPB: Digital Temperature Sensor and Thermal Watchdog with Two-Wire Interface; Part Description: -25° to +100°C ±2°C Digital Temperature Sensor and Thermal Watchdog with Two-Wire Interface; Manufacturer: TEXAS INSTRUMENTS; Table: Sensors; Part Number: LM75AIMM/NOPB; Component Kind: Standard; Component Type: Standard; Device: LM75AIMM/NOPB; PackageDescription: SOP, 0.65mm pitch; 8 pin,3.00mm W X 3.00mm L X 1.09mm H bodyI, PC Medium Density; Manufacturer Part Number: LM75AIMM/NOPB; Pin Count: 8; Case: SSOP8; Mounted: Yes; Socket: No; SMD: Yes; ComponentHeight: 1.09mm; HelpURL: \\cern.ch\dfs\Applications\Altium\Datasheets\LM75AIMM-NOPB.pdf; Author: CERN DEM JLC; CreateDate: 2012-10-15; LatestRevisionDate: 2012-10-15
IC10 = 24AA64T-I/MC: 1.7V-5.5V 64K I2C Serial EEPROM; Part Description: 1.7V-5.5V, 64K  (8K x 8-bit) I2C Serial EEPROM; Manufacturer: MICROCHIP TECHNOLOGY; PressFit: No; Bonding: No; Part Number: 24AA64T-I/MC; Component Kind: Standard; Component Type: Standard; Device: 24AA64T-I/MC; PackageDescription: SON (DFN), 0.50mm pitch, 8 pin, 2mm X 3mm X 1.00mm H body (w/thermal tab 1.75 X 1.55mm),  IPC Medium Density; Manufacturer Part Number: 24AA64T-I/MC; Pin Count: 9; Case: DFN8; Mounted: Yes; Socket: No; SMD: Yes; Sense: No; ComponentHeight: 1mm; HelpURL: \\cern.ch\dfs\Applications\Altium\Datasheets\24AA64T-I-MC.pdf; Author: CERN DEM JLC; CreateDate: 18.11.2009; LatestRevisionDate: 24.01.2011
R51 R52 R55 R56 = R0402_10K_1%_0.0625W_100PPM: Resistor - 1%; Part Description: General Purpose Thick Film Chip Resistor; Manufacturer: GENERIC; Manufacturer1 Part Number: 232270671003L; TC: ±100ppm/°C; Table: Resistors SMD; Part Number: R0402_10K_1%_0.0625W_100PPM; Component Kind: Standard; Component Type: Standard; Pin Count: 2; Value: 10k; Status: Not recommended; Power: 0.0625W; Tolerance: ±1%; Manufacturer Part Number: R0402_10K_1%_0.0625W_100PPM; Case: 0402; Mounted: Yes; Socket: No; SMD: Yes; Manufacturer1 Example: YAGEO PHYCOMP; Manufacturer1 ComponentHeight: 0.4mm; HelpURL: \\cern.ch\dfs\Applications\Altium\Datasheets\R0402_Phycomp_RC0402.pdf; Author: CERN DEM JLC; CreateDate: 3/12/2007; LatestRevisionDate: 17/10/2012
R53 R54 = R0402_0R_JUMPER: Resistor - 1%; Part Description: 1A (0.05R Max DC Resistance) Zero Ohm Jumper; Manufacturer: GENERIC; Manufacturer1 Part Number: 232270591001; Table: Resistors SMD; Part Number: R0402_0R_JUMPER; Component Kind: Standard; Component Type: Standard; Pin Count: 2; Value: 0; Status: Not recommended; Manufacturer Part Number: R0402_0R_JUMPER; Case: 0402; Mounted: Yes; Socket: No; SMD: Yes; Manufacturer1 Example: PHYCOMP; Manufacturer1 ComponentHeight: 0.4mm; HelpURL: \\cern.ch\dfs\Applications\Altium\Datasheets\R0402_Phycomp_RC0402.pdf; Author: CERN DEM JLC; CreateDate: 2007-12-03; LatestRevisionDate: 2008-03-13

## Sheet Translators_AWG.SchDoc: FMC DAC 1.5GS 4CH
size 420 x 297 mm; Author: G.Kasprowicz; CompanyName: WUT ISE; DrawnBy: G.Kasprowicz; Organization: WUT ISE; Address1: PW ISE; Address2: Nowowiejska 15/19 00-665 Warsaw; Address3: gkasprow@gmail.com; DocumentNumber: 12; Revision: 1; SheetNumber: 12; SheetTotal: 12; ModifiedBy: -; CheckedDate: -; Title2: Translators; DivGrp: WUT ISE; Designer: G.Kasprowicz; ModifiedDate: -; ProjectName: Sensor Box
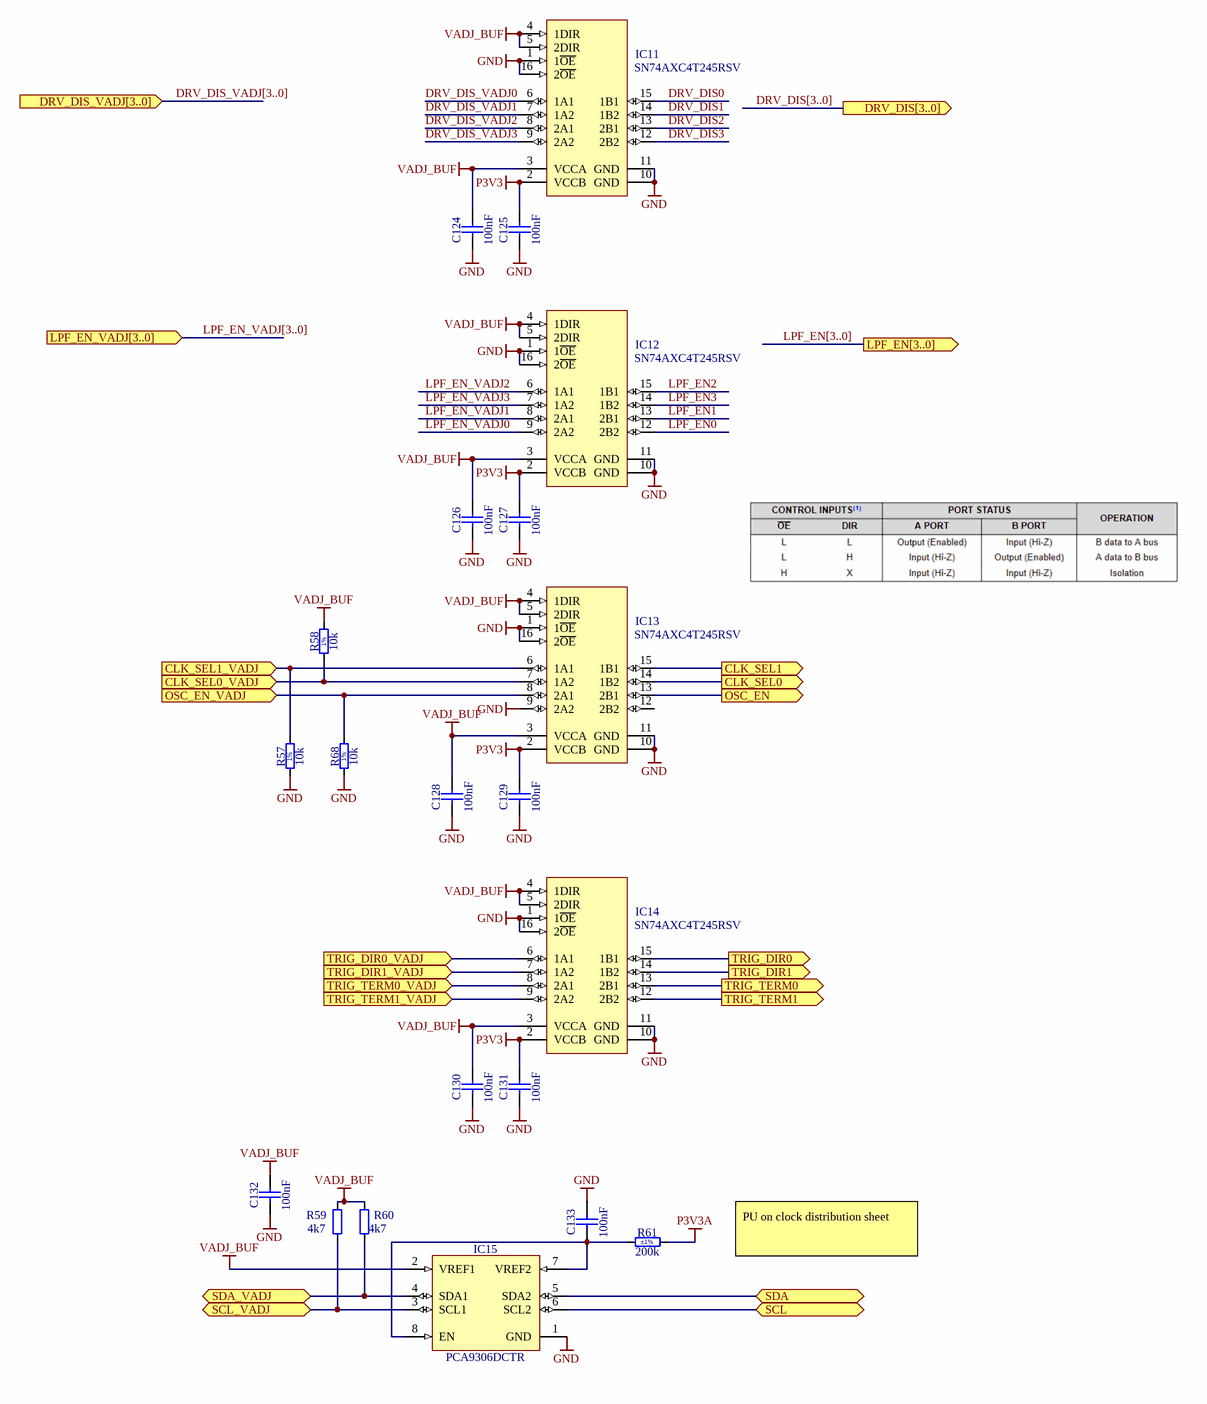
[diagram p8: Translators_AWG.SchDoc]

### Parts
C124  100nF  [CAPC1005X55N]
C125  100nF  [CAPC1005X55N]
C126  100nF  [CAPC1005X55N]
C127  100nF  [CAPC1005X55N]
C128  100nF  [CAPC1005X55N]
C129  100nF  [CAPC1005X55N]
C130  100nF  [CAPC1005X55N]
C131  100nF  [CAPC1005X55N]
C132  100nF  [CAPC1005X55N]
C133  100nF  [CAPC1005X55N]
IC11  SN74AXC4T245RSV  [QFN40P180X260X55-16N]
IC12  SN74AXC4T245RSV  [QFN40P180X260X55-16N]
IC13  SN74AXC4T245RSV  [QFN40P180X260X55-16N]
IC14  SN74AXC4T245RSV  [QFN40P180X260X55-16N]
IC15  PCA9306DCTR  [SOP65P400X130-8N]
R57  10k  [RESC1005X40N]
R58  10k  [RESC1005X40N]
R59  4k7  [RESC1005X40N]
R60  4k7  [RESC1005X40N]
R61  200k  Tolerance: ±1%  [RESC1005X40N]
R68  10k  [RESC1005X40N]

### Ports
CLK_SEL0 (out), CLK_SEL0_VADJ (in), CLK_SEL1 (out), CLK_SEL1_VADJ (in), DRV_DIS[3..0] (out), DRV_DIS_VADJ[3..0] (in), LPF_EN[3..0] (out), LPF_EN_VADJ[3..0] (in), OSC_EN (out), OSC_EN_VADJ (in), SCL (bidir), SCL_VADJ (bidir), SDA (bidir), SDA_VADJ (bidir), TRIG_DIR0 (out), TRIG_DIR0_VADJ (in), TRIG_DIR1 (out), TRIG_DIR1_VADJ (in), TRIG_TERM0 (out), TRIG_TERM0_VADJ (in), TRIG_TERM1 (out), TRIG_TERM1_VADJ (in)

### Nets
GND: C124.1 C125.1 C126.1 C127.1 C128.1 C129.1 C130.1 C131.1 C132.1 C133.2 IC11.1(1~{OE}) IC11.10(GND) IC11.11(GND) IC11.16(2~{OE}) IC12.1(1~{OE}) IC12.10(GND) IC12.11(GND) IC12.16(2~{OE}) IC13.1(1~{OE}) IC13.9(2A2) IC13.10(GND) IC13.11(GND) IC13.16(2~{OE}) IC14.1(1~{OE}) IC14.10(GND) IC14.11(GND) IC14.16(2~{OE}) IC15.1(GND) R57.1 R68.1
P3V3: C125.2 C127.2 C129.2 C131.2 IC11.2(VCCB) IC12.2(VCCB) IC13.2(VCCB) IC14.2(VCCB)
P3V3A: R61.2
VADJ_BUF: C124.2 C126.2 C128.2 C130.2 C132.2 IC11.3(VCCA) IC11.4(1DIR) IC11.5(2DIR) IC12.3(VCCA) IC12.4(1DIR) IC12.5(2DIR) IC13.3(VCCA) IC13.4(1DIR) IC13.5(2DIR) IC14.3(VCCA) IC14.4(1DIR) IC14.5(2DIR) IC15.2(VREF1) R58.2 R59.2 R60.2
CLK_SEL0: IC13.14(1B2) ; port CLK_SEL0
CLK_SEL1: IC13.15(1B1) ; port CLK_SEL1
DRV_DIS0: IC11.15(1B1)
DRV_DIS1: IC11.14(1B2)
DRV_DIS2: IC11.13(2B1)
DRV_DIS3: IC11.12(2B2)
DRV_DIS_VADJ0: IC11.6(1A1)
DRV_DIS_VADJ1: IC11.7(1A2)
DRV_DIS_VADJ2: IC11.8(2A1)
DRV_DIS_VADJ3: IC11.9(2A2)
HA01_CC_N: IC15.4(SDA1) R60.1 ; port SDA_VADJ
HA01_CC_P: IC15.3(SCL1) R59.1 ; port SCL_VADJ
HA02_N: IC14.8(2A1) ; port TRIG_TERM0_VADJ
HA02_P: IC14.9(2A2) ; port TRIG_TERM1_VADJ
HA06_P: IC14.6(1A1) ; port TRIG_DIR0_VADJ
HA07_P: IC14.7(1A2) ; port TRIG_DIR1_VADJ
HA13_N: IC13.8(2A1) R68.2 ; port OSC_EN_VADJ
HA16_N: IC13.6(1A1) R57.2 ; port CLK_SEL1_VADJ
HA16_P: IC13.7(1A2) R58.1 ; port CLK_SEL0_VADJ
LPF_EN0: IC12.12(2B2)
LPF_EN1: IC12.13(2B1)
LPF_EN2: IC12.15(1B1)
LPF_EN3: IC12.14(1B2)
LPF_EN_VADJ0: IC12.9(2A2)  [project net HA11_P]
LPF_EN_VADJ1: IC12.8(2A1)  [project net HA12_P]
LPF_EN_VADJ2: IC12.6(1A1)  [project net HA06_N]
LPF_EN_VADJ3: IC12.7(1A2)  [project net HA12_N]
NetC133_1: C133.1 IC15.7(VREF2) IC15.8(EN) R61.1
NetIC13_13: IC13.13(2B1) ; port OSC_EN
NetIC14_12: IC14.12(2B2) ; port TRIG_TERM1
NetIC14_13: IC14.13(2B1) ; port TRIG_TERM0
NetIC14_14: IC14.14(1B2) ; port TRIG_DIR1
NetIC14_15: IC14.15(1B1) ; port TRIG_DIR0
NetIC15_5: IC15.5(SDA2) ; port SDA
NetIC15_6: IC15.6(SCL2) ; port SCL

Not connected (* = marked no-connect by the designer): IC13 12(2B2)

### Buses and harness runs
bus DRV_DIS[3..0] = port DRV_DIS[3..0]
bus DRV_DIS_VADJ[3..0] = port DRV_DIS_VADJ[3..0]
bus LPF_EN[3..0] = port LPF_EN[3..0]
bus LPF_EN_VADJ[3..0] = port LPF_EN_VADJ[3..0]

### Notes on the sheet
- PU on clock distribution sheet
- Project/Equipment
- Document
- Designer
- Drawn by
- Check.by
- Copyright WUT ISE 2018.
  This documentation describes Open Hardware and is licensed under the CERN OHL v.1.1. You may redistribute and modify this documentation under the terms of the CERN OHL v.1.1. (http://ohwr.org/CERNOHL). This documentation is distributed WITHOUT ANY EXPRESS OR IMPLIED WARRANTY, INCLUDING OF MERCHANTABILITY, SATISFACTORY QUALITY AND FITNESS FOR A PARTICULAR PURPOSE. Please see the CERN OHL v.1.1 for applicable conditions.
- Contact
- File
- Last Mod.
- Print Date
- Sheet
- Size
- A3
- of
- Rev
- (in symbol R0402_10K_1%_0.0625W_100PPM) 1%

### Library data of the parts
C124-C133 = CC0402_100NF_16V_10%_X7R: Non-polarised capacitor; Part Description: SMD Multilayer Chip Ceramic Capacitor; Manufacturer: GENERIC; Manufacturer1 Part Number: GRM155R71C104KA88D; Voltage: 16V; TC: X7R; Tolerance: ±10%; Part Number: CC0402_100NF_16V_10%_X7R; Component Kind: Standard; Component Type: Standard; Pin Count: 2; Value: 100nF; Status: Not Recommended; Manufacturer Part Number: CC0402_100NF_16V_10%_X7R; Case: 0402; Mounted: Yes; Socket: No; SMD: Yes; Sense: No; Manufacturer1 Example: MURATA; Manufacturer1 ComponentHeight: 0.55mm; HelpURL: \\cern.ch\dfs\Applications\Altium\Datasheets\CC0402_X7R_MURATA_GRM.pdf; Author: CERN DEM JLC; CreateDate: 05.12.2013; LatestRevisionDate: 03.12.2007
IC11-IC14 = SN74AXC4T245: 4-Bit Dual-Supply Bus Transceiver with Configurable Voltage Translation and 3-State Output; Part Description: 4-Bit Dual-Supply Bus Transceiver With Configurable Voltage Translation and 3-State Outputs; Manufacturer: TEXAS INSTRUMENTS; PressFit: No; Bonding: No; Part Number: SN74AXC4T245RSV; Component Kind: Standard; Component Type: Standard; Device: SN74AXC4T245RSV; PackageDescription: QFN, 0.40mm Pitch, Rect.; 16 Pin, 2.60mm L X 1.80mm W X 0.55mm H Body, IPC Medium Density; Status: Recommended; Manufacturer Part Number: SN74AXC4T245RSV; Pin Count: 16; Case: QFN16; Mounted: Yes; Socket: No; SMD: Yes; Sense: No; ComponentHeight: 0.55mm; Author: GK; HelpURL: \\cern.ch\dfs\Applications\Altium\Datasheets\SN74AVC4T245RSVR.pdf; CreateDate: 08.07.2014; LatestRevisionDate: 30.03.2017
IC15 = PCA9306DCTR: Dual Bidirectional I2C Bus And SMBus Voltage-Level Translator; Manufacturer: TEXAS INSTRUMENTS; Table: Analog & Interface; Part Number: PCA9306DCTR; Component Kind: Standard; Component Type: Standard; Device: PCA9306DCTR; PackageDescription: SOP, 0.65mm, Pitch; 8 Pin, 2.80mm W X 2.95mm L X 1.30mm H Body, PC Medium Density; Part Description: Dual Bidirectional I2C Bus And SMBus Voltage-Level Translator; Manufacturer Part Number: PCA9306DCTR; Pin Count: 8; Case: SSOP8; Mounted: Yes; Socket: No; SMD: Yes; ComponentHeight: 1.3mm; Author: CERN DEM JLC; HelpURL: \\cern.ch\dfs\Applications\Altium\Datasheets\PCA9306DCTR.pdf; CreateDate: 2013-02-25; LatestRevisionDate: 2013-02-25
R57 R58 R68 = R0402_10K_1%_0.0625W_100PPM: as R51 on sheet EEPROM_Temp; Part Number: R0402_10K_1%_0.0625W_100PPM; Component Kind: Standard; Component Type: Standard; Pin Count: 2; Value: 10k; Status: Not recommended; Power: 0.0625W; Tolerance: ±1%; Manufacturer Part Number: R0402_10K_1%_0.0625W_100PPM; Case: 0402; Mounted: Yes; Socket: No; SMD: Yes; Manufacturer1 Example: YAGEO PHYCOMP; Manufacturer1 ComponentHeight: 0.4mm; HelpURL: \\cern.ch\dfs\Applications\Altium\Datasheets\R0402_Phycomp_RC0402.pdf; Author: CERN DEM JLC; CreateDate: 3/12/2007; LatestRevisionDate: 17/10/2012
R59 R60 = R0402_4k7_1%_0.0625W_100PPM: Resistor - 1%; Part Description: General Purpose Thick Film Chip Resistor; Manufacturer: GENERIC; Manufacturer1 Part Number: 232270674702L; TC: ±100ppm/°C; PressFit: No; Part Number: R0402_4K7_1%_0.0625W_100PPM; Component Kind: Standard; Component Type: Standard; Pin Count: 2; Value: 4k7; Status: Not Recommended; Power: 0.0625W; Tolerance: ±1%; Manufacturer Part Number: R0402_4K7_1%_0.0625W_100PPM; Case: 0402; Mounted: Yes; Socket: No; SMD: Yes; Manufacturer1 Example: YAGEO PHYCOMP; Manufacturer1 ComponentHeight: 0.4mm; HelpURL: \\cern.ch\dfs\Applications\Altium\Datasheets\R0402_Phycomp_RC0402.pdf; Author: CERN DEM JLC; CreateDate: 03.12.2007; LatestRevisionDate: 17.10.2012; Sense: No
R61 = R0402_200K_1%_0.0625W_100PPM: Resistor - 1%; Part Description: General Purpose Thick Film Chip Resistor; Manufacturer: GENERIC; Manufacturer1 Part Number: 232270672004L; TC: ±100ppm/°C; PressFit: No; Part Number: R0402_200K_1%_0.0625W_100PPM; Component Kind: Standard; Component Type: Standard; Pin Count: 2; Value: 200k; Status: Not Recommended; Power: 0.0625W; Manufacturer Part Number: R0402_200K_1%_0.0625W_100PPM; Case: 0402; Mounted: Yes; Sense: No; Socket: No; SMD: Yes; Manufacturer1 Example: YAGEO PHYCOMP; Manufacturer1 ComponentHeight: 0.4mm; HelpURL: \\cern.ch\dfs\Applications\Altium\Datasheets\R0402_Phycomp_RC0402.pdf; Author: CERN DEM JLC; CreateDate: 03.12.2007; LatestRevisionDate: 17.10.2012

## Sheet IO_CTRL.SchDoc: FMC DAC 1.5GS 4CH
size 420 x 297 mm; Author: G.Kasprowicz; CompanyName: WUT ISE; DrawnBy: G.Kasprowicz; Organization: WUT ISE; Address1: PW ISE; Address2: Nowowiejska 15/19 00-665 Warsaw; Address3: gkasprow@gmail.com; DocumentNumber: 8; Revision: 1; SheetNumber: 8; SheetTotal: 12; ModifiedBy: -; CheckedDate: -; Title2: IO CTRL; DivGrp: WUT ISE; Designer: G.Kasprowicz; ModifiedDate: -; ProjectName: Sensor Box
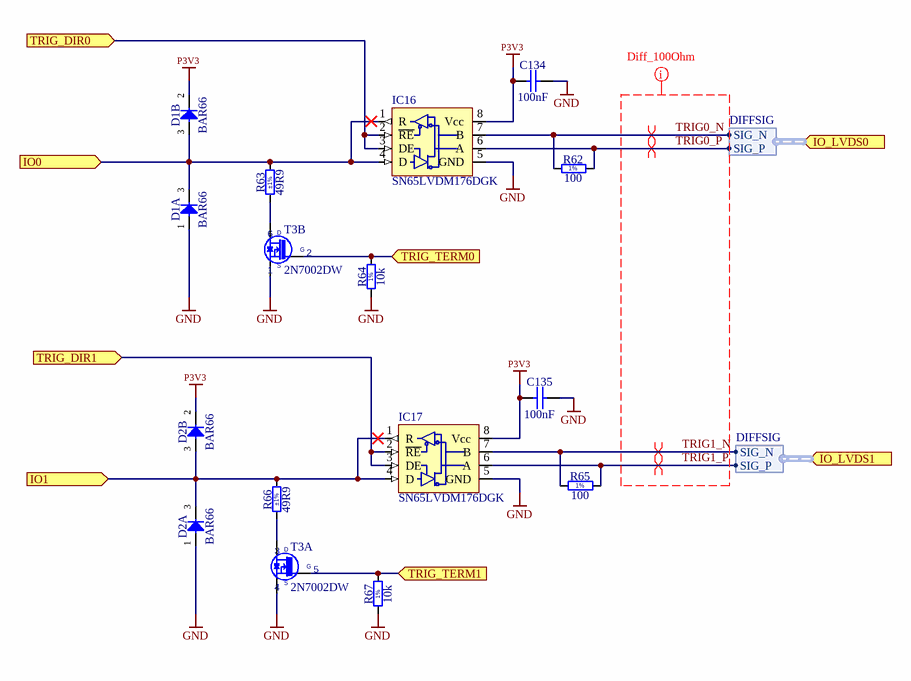
[diagram p9: IO_CTRL.SchDoc]

### Parts
C134  100nF  [CAPC1005X55N]
C135  100nF  [CAPC1005X55N]
D1  BAR66  [SOT95P240X110-3N]  (parts A,B of 2)
D2  BAR66  [SOT95P240X110-3N]  (parts A,B of 2)
IC16  SN65LVDM176DGK  [MSOP8 TI/AD]
IC17  SN65LVDM176DGK  [MSOP8 TI/AD]
R62  100  [RESC0603X28N]
R63  49R9  Tolerance: ±1%  [RESC3225X70N]
R64  10k  [RESC1005X40N]
R65  100  [RESC0603X28N]
R66  49R9  Tolerance: ±1%  [RESC3225X70N]
R67  10k  [RESC1005X40N]
T3  2N7002DW  [SOT65P210X110-6N]  (parts A,B of 2)

### Ports
IO0 (in), IO1 (in), IO_LVDS0 (in, harness DIFFSIG), IO_LVDS1 (in, harness DIFFSIG), TRIG_DIR0 (in), TRIG_DIR1 (in), TRIG_TERM0 (in), TRIG_TERM1 (in)

### Harnesses
DIFFSIG: SIG_N, SIG_P

### Nets
GND: C134.2 C135.2 D1.1(A) D2.1(A) IC16.5(GND) IC17.5(GND) R64.1 R67.1 T3.1(S2) T3.4(S1)
P3V3: C134.1 C135.1 D1.2(C) D2.2(C) IC16.8(Vcc) IC17.8(Vcc)
TRIG0_N: IC16.7(B) R62.1 ; port IO_LVDS0.SIG_N  [project net HB20_N]
TRIG0_P: IC16.6(A) R62.2 ; port IO_LVDS0.SIG_P  [project net HB20_P]
TRIG1_N: IC17.7(B) R65.1 ; port IO_LVDS1.SIG_N  [project net HB17_CC_N]
TRIG1_P: IC17.6(A) R65.2 ; port IO_LVDS1.SIG_P  [project net HB17_CC_P]
NetD1_3: D1.3(COMAC) IC16.1(R) IC16.4(D) R63.2 ; port IO0
NetD2_3: D2.3(COMAC) IC17.1(R) IC17.4(D) R66.2 ; port IO1
NetIC14_12: R67.2 T3.5(G1) ; port TRIG_TERM1
NetIC14_13: R64.2 T3.2(G2) ; port TRIG_TERM0
NetIC14_14: IC17.2(~{RE}) IC17.3(DE) ; port TRIG_DIR1
NetIC14_15: IC16.2(~{RE}) IC16.3(DE) ; port TRIG_DIR0
NetR63_1: R63.1 T3.6(D2)
NetR66_1: R66.1 T3.3(D1)

### Layout directives
differential pair: HB17_CC_N, HB17_CC_P, HB20_N, HB20_P
net class Diff_100Ohm: TRIG0_N, TRIG0_P, TRIG1_N, TRIG1_P

### Notes on the sheet
- Project/Equipment
- Document
- Designer
- Drawn by
- Check.by
- Copyright WUT ISE 2018.
  This documentation describes Open Hardware and is licensed under the CERN OHL v.1.1. You may redistribute and modify this documentation under the terms of the CERN OHL v.1.1. (http://ohwr.org/CERNOHL). This documentation is distributed WITHOUT ANY EXPRESS OR IMPLIED WARRANTY, INCLUDING OF MERCHANTABILITY, SATISFACTORY QUALITY AND FITNESS FOR A PARTICULAR PURPOSE. Please see the CERN OHL v.1.1 for applicable conditions.
- Contact
- File
- Last Mod.
- Print Date
- Sheet
- Size
- A3
- of
- Rev
- (in symbol 2N7002DW, part A) D; G; S
- (in symbol 2N7002DW, part B) D; G; S
- (in symbol R0201_100R_1%_0.05W_200PPM) 1%
- (in symbol R0402_10K_1%_0.0625W_100PPM) 1%

### Library data of the parts
C134 C135 = CC0402_100NF_16V_10%_X5R: as C121-C123 on sheet EEPROM_Temp; Part Number: CC0402_100NF_16V_10%_X5R; Component Kind: Standard; Component Type: Standard; Pin Count: 2; Value: 100nF; Status: None; Manufacturer Part Number: CC0402_100NF_16V_10%_X5R; Case: 0402; Mounted: Yes; Socket: No; SMD: Yes; Sense: No; Manufacturer1 Example: MURATA; Manufacturer1 ComponentHeight: 0.55mm; HelpURL: \\cern.ch\dfs\Applications\Altium\Datasheets\CC0402_X5R_MURATA_GRM.pdf; Author: CERN DEM JLC; CreateDate: 10.12.2013; LatestRevisionDate: 10.12.2013
D1 D2 = BAR66: Serial Diode; Part Description: Silicon PIN Diode Array (Series Connected); Manufacturer: INFINEON; Voltage: 150V; Power: 250mA; Table: Diodes; Part Number: BAR66; Component Kind: Standard; Component Type: Standard; Device: BAR66; PackageDescription: SOT23 3-Leads, Pitch 0.95mm - Body 1.3x2.9mm, IPC Medium Density; Manufacturer Part Number: BAR66; Pin Count: 3; Case: SOT23; Mounted: Yes; Socket: No; SMD: Yes; ComponentHeight: 1.1mm; HelpURL: \\cern.ch\dfs\Applications\Altium\Datasheets\BAR66.pdf; Author: CERN DEM JLC; CreateDate: 18/1/2010; LatestRevisionDate: 5/10/2010
IC16 IC17 = SN65LVDM176: High Speed Differential Transceiver LVDS/LVTTL; ComponentLink1Description: Datasheet; ComponentLink1URL: C:\TSR\Laurin\Projects\FMC\CERN DAC\Parts\Digital\SN65LVDM176.pdf
R62 R65 = R0201_100R_1%_0.05W_200PPM: Resistor - 1%; Part Description: Thick Film Chip Resistor; Manufacturer: GENERIC; Manufacturer1 Part Number: CRCW0201100RFNED; Power: 0.05W; TC: ±200ppm/°C; PressFit: No; Part Number: R0201_100R_1%_0.05W_200PPM; Component Kind: Standard; Component Type: Standard; Pin Count: 2; Value: 100; Status: Not Recommended; Tolerance: ±1%; Manufacturer Part Number: R0201_100R_1%_0.05W_200PPM; Case: 0201; Mounted: Yes; Socket: No; SMD: Yes; Manufacturer1 Example: VISHAY; Manufacturer1 ComponentHeight: 0.27mm; HelpURL: \\cern.ch\dfs\Applications\Altium\Datasheets\R0201_VISHAY_CRCW0201 e3.pdf; Author: CERN DEM JLC; CreateDate: 13.11.2014; LatestRevisionDate: 13.11.2014; Sense: No
R63 R66 = R1210_49R9_1%_0.5W_100PPM_VISHAY_CRCW: Resistor - 1%; Part Description: Thick Film Chip Resistor; Manufacturer: VISHAY DRALORIC; Manufacturer Part Number: CRCW121049R9FK; Power: 0.5W; TC: ±100ppm/°C; PressFit: No; Part Number: R1210_49R9_1%_0.5W_100PPM_VISHAY_CRCW; Component Kind: Standard; Component Type: Standard; Pin Count: 2; Value: 49R9; Status: None; Case: 1210; Mounted: Yes; Sense: No; Socket: No; SMD: Yes; ComponentHeight: 0.7mm; HelpURL: \\cern.ch\dfs\Applications\Altium\Datasheets\R1210_VISHAY_CRCW1210.pdf; Author: CERN DEM JMW; CreateDate: 06.08.2014; LatestRevisionDate: 06.08.2014
R64 R67 = R0402_10K_1%_0.0625W_100PPM: as R51 on sheet EEPROM_Temp; Part Number: R0402_10K_1%_0.0625W_100PPM; Component Kind: Standard; Component Type: Standard; Pin Count: 2; Value: 10k; Status: Not recommended; Power: 0.0625W; Tolerance: ±1%; Manufacturer Part Number: R0402_10K_1%_0.0625W_100PPM; Case: 0402; Mounted: Yes; Socket: No; SMD: Yes; Manufacturer1 Example: YAGEO PHYCOMP; Manufacturer1 ComponentHeight: 0.4mm; HelpURL: \\cern.ch\dfs\Applications\Altium\Datasheets\R0402_Phycomp_RC0402.pdf; Author: CERN DEM JLC; CreateDate: 3/12/2007; LatestRevisionDate: 17/10/2012
T3 = 2N7002DW: 60 V, 115 mA, Dual N-Channel Field Effect Transistor, Enhancement Mode; Part Description: 60V 115mA Dual N-Channel Field Effect Transistor, Enhancement Mode; Manufacturer: ON SEMICONDUCTOR; PressFit: No; Bonding: No; Part Number: 2N7002DW; Component Kind: Standard; Component Type: Standard; Device: 2N7002DW; PackageDescription: SOT363, SC70-6, 0.65mm Pitch; 6 Pin, 1.25mm W X 2.00mm L X 1.10mm H body, IPC Medium Density; Manufacturer Part Number: 2N7002DW; Pin Count: 6; Case: SOT363; Mounted: Yes; Socket: No; SMD: Yes; Sense: No; ComponentHeight: 1.1mm; HelpURL: \\cern.ch\dfs\Applications\Altium\Datasheets\2N7002DW.pdf; Author: CERN DEM BC; CreateDate: 25.11.2020; LatestRevisionDate: 25.11.2020